# EAGLE design resonant-bp (EAGLE 7.7.0)
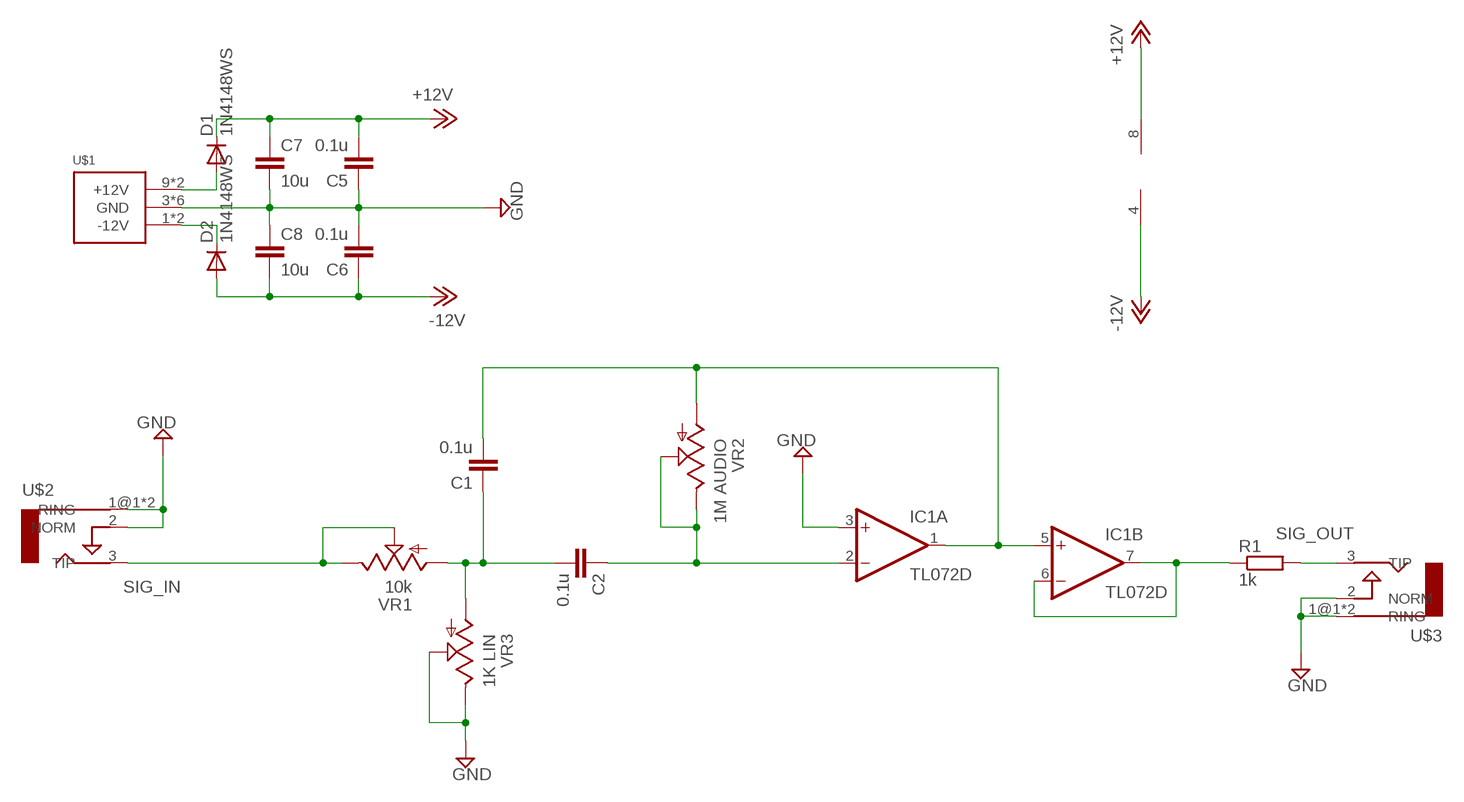
[diagram p0: schematic, sheet 1]

## Parts
C1  0.1u  C-EUC0805  [C0805]
C2  0.1u  C-EUC0805  [C0805]
C5  0.1u  C-EUC0805  [C0805]
C6  0.1u  C-EUC0805  [C0805]
C7  10u  C-EUC0805  [C0805]
C8  10u  C-EUC0805  [C0805]
D1  1N4148WS  DIODE-SOD323-W  [SOD323-W]
D2  1N4148WS  DIODE-SOD323-W  [SOD323-W]
IC1  TL072D  [SO08]
R1  1k  R-EU_R0805  [R0805]
U$1  POWER_SIMPLE10  [POWER_10]
U$2  AUDIO-JACKERTHENVAR  [ERTHENVAR-JACK]
U$3  AUDIO-JACKERTHENVAR  [ERTHENVAR-JACK]
VR1  10k  9MM_SNAP-IN_POT_  [9MM_SNAP-IN_POT]
VR2  1M AUDIO  9MM_SNAP-IN_POT_  [9MM_SNAP-IN_POT]
VR3  1K LIN  9MM_SNAP-IN_POT_  [9MM_SNAP-IN_POT]

## Nets
+12V: C5.2 C7.1 D1.C IC1.8(P:V+)
-12V: C6.1 C8.2 D2.A IC1.4(P:V-)
GND: C5.1 C6.2 C7.2 C8.1 IC1.3(A:+IN) U$1.3(GND) U$1.4(GND) U$1.5(GND) U$1.6(GND) U$1.7(GND) U$1.8(GND) U$2.1@1(RING) U$2.1@2(RING) U$2.2(NORM) U$3.1@1(RING) U$3.1@2(RING) U$3.2(NORM) VR3.2(S) VR3.3(E)
N$1: C1.1 C2.2 VR1.1(A) VR3.1(A)
N$2: D2.C U$1.1(-12V) U$1.2(-12V)
N$3: D1.A U$1.9(+12V) U$1.10(+12V)
N$4: C1.2 IC1.1(A:OUT) IC1.5(B:+IN) VR2.1(A)
N$5: C2.1 IC1.2(A:-IN) VR2.2(S) VR2.3(E)
N$9: IC1.6(B:-IN) IC1.7(B:OUT) R1.1
SIG_IN: U$2.3(TIP) VR1.2(S) VR1.3(E)
SIG_OUT: R1.2 U$3.3(TIP)

## Library data of the parts
C1 C2 C5-C8 = rcl:C-EU: CAPACITOR, European symbol
D1 D2 = diode:DIODE-: DIODE
IC1 = linear:TL072: OP AMP
R1 = rcl:R-EU_: RESISTOR, European symbol
U$1 = eurorack:POWER_SIMPLE
U$2 U$3 = erthenvar:AUDIO-JACK: Switching Mono 3.5mm Audio Jack from Erthenvar.
VR1-VR3 = MusicThingModular:9MM_SNAP-IN_POT: 9mm vertical snap-in pot, Alpha / Panasonic style

## Board
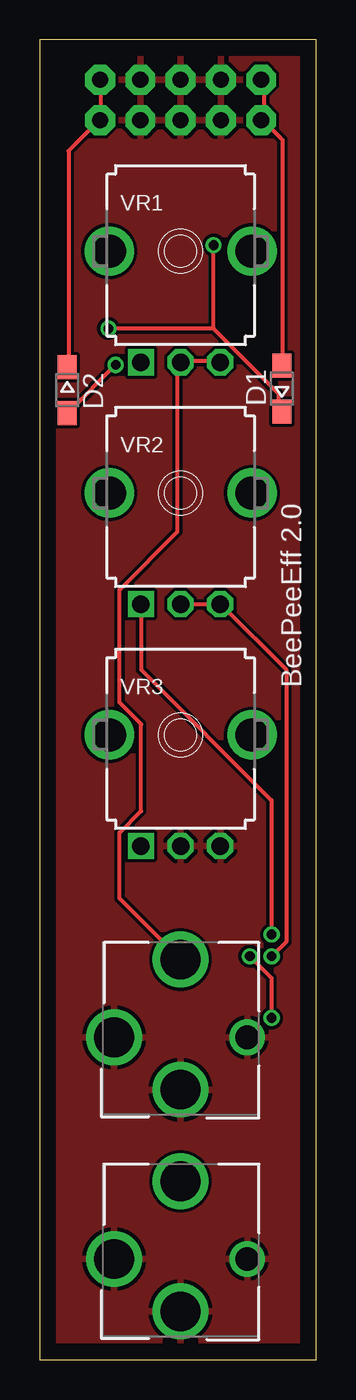
[diagram p1: board, top side]
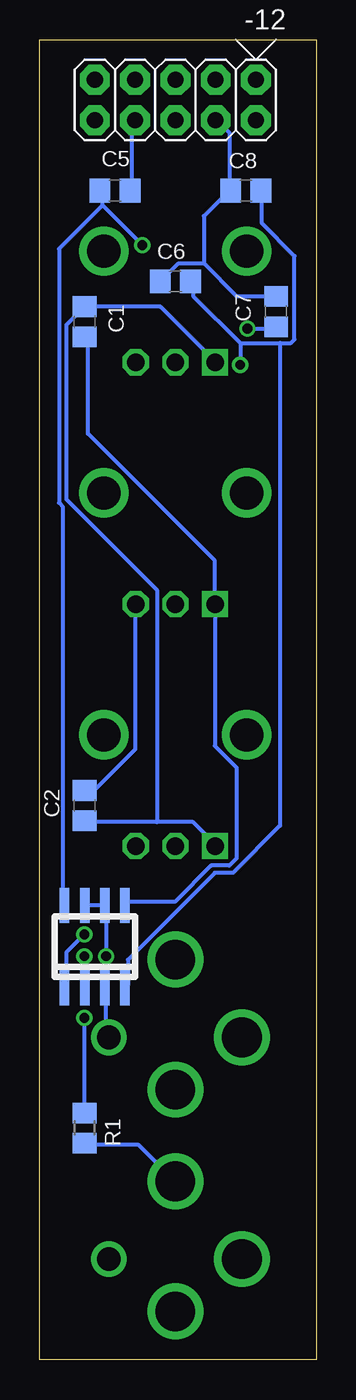
[diagram p2: board, bottom side, seen from below]

Size 17.45 x 83.17 mm. Coordinates in mm from the lower left corner, seen from the top.
Outline: 0,0 17.45,0 17.45,83.17 0,83.17 0,0
Copper layers (1*16): Top 0.035mm / dielectric 1.5mm / Bottom 0.035mm
Design rules "default": minimum track width 10mil, minimum drill 24mil, track to track 8mil, track to pad 8mil, pad to pad 8mil, via to via 8mil, smd to smd 8mil, copper to edge 40mil, drill to drill 8mil, minimum pad ring 10mil, minimum via ring 8mil, stop-mask expansion 4mil, vias tented up to drill 0mil, thermal gap 10mil

### Footprints (pad centres in the part's own frame; a part is rotated, then mirrored left to right if it is on the bottom)
C0805 = smd 1.3 x 1.5: 1 -0.95,0; 2 0.95,0
SOD323-W = smd 1.5 x 1.2: A 1.45,0; C -1.45,0
SO08 = smd 0.6 x 2.2: 1 -1.905,-2.6; 2 -0.635,-2.6; 3 0.635,-2.6; 4 1.905,-2.6; 5 1.905,2.6; 6 0.635,2.6; 7 -0.635,2.6; 8 -1.905,2.6
R0805 = smd 1.3 x 1.5: 1 -0.95,0; 2 0.95,0
POWER_10 = drill 1.016 pad 1.88 octagon: 1 -5.08,-1.27; 2 -5.08,1.27; 3 -2.54,-1.27; 4 -2.54,1.27; 5 0,-1.27; 6 0,1.27; 7 2.54,-1.27; 8 2.54,1.27; 9 5.08,-1.27; 10 5.08,1.27
ERTHENVAR-JACK = drill 2.5: 1@1 -4.2,0; 2 0,-3.3; 3 0,4.9 | drill 1.5: 1@2 4.2,0
9MM_SNAP-IN_POT = drill 1.1 square: 1 -2.5,-7 | drill 1.1 octagon: 2 0,-7; 3 2.5,-7 | drill 2.1 pad 2.794: CHASSIS1 -4.5,0; CHASSIS2 4.5,0

### Placement (x,y rotation side)
C1  14.61,65.41 270 bottom
C2  14.61,34.93 270 bottom
C5  12.7,73.66 180 bottom
C6  8.89,67.94 180 bottom
C7  2.54,66.04 90 bottom
C8  4.45,73.66 0 bottom
D1  15.28,61.19 90 top
D2  1.74,61.1 270 top
IC1  13.97,26.04 0 bottom
R1  14.61,14.61 270 bottom
U$1  8.89,79.38 180 bottom
U$2  8.89,20.32 0 top
U$3  8.89,6.35 0 top
VR1  8.89,69.85 0 top
VR2  8.89,54.61 0 top
VR3  8.89,39.37 0 top

### Tracks (layer width: path | path; a pad name or v marks a point on that pad's centre or on a via)
+12V  (via drill 0.61)
  Top 0.254: 10.97,64.97 v4.34,64.97 | 10.97,64.97 15.09,60.86 15.09,59.94 D1.C | 10.97,64.97 v10.97,70.23
  Bottom 0.254: v4.34,64.97 2.74,64.97 C7.1 | 13.49,72.75 13.49,73.66 C5.2 | v10.97,70.23 13.49,72.75 | 13.49,72.75 16.23,70 16.23,54 16,53.77 16,28.85 IC1.8
-12V  (via drill 0.61)
  Top 0.254: v4.8,62.69 1.83,59.72 D2.A
  Bottom 0.254: 4.8,64.06 v4.8,62.69 | 4.8,64.06 7.77,67.03 7.77,67.94 C6.1 | 4.8,64.06 2.29,64.06 | 2.29,64.06 1.6,64.06 1.37,64.29 1.37,69.55 3.43,71.6 3.43,73.66 C8.2 | 2.29,64.06 2.29,33.66 5.26,30.68 6.4,30.68 11.89,25.2 11.89,23.6 IC1.4
GND
  Bottom 0.254: 7.09,69.09 5.03,67.03 2.74,67.03 C7.2 | 7.09,69.09 8.69,69.09 C6.2 | 5.49,73.66 5.49,77.32 6.17,78 U$1.4 | C5.1 11.66,73.66 11.66,77.77 11.43,78 U$1.8 | IC1.3 13.26,23.37 13.26,20.4 U$2.1@2 | 7.09,69.09 7.09,72.06 5.49,73.66 | 5.49,73.66 C8.1
  pour Top: 0,83.18 17.78,83.18 17.78,-0.64 0,-0.64
N$1
  Bottom 0.254: 10.06,33.88 7.77,33.88 6.4,32.51 VR3.1 | 10.06,33.88 14.4,33.88 C2.2 | VR1.1 6.4,62.92 9.83,66.34 14.4,66.34 C1.1 14.63,66.34 15.77,65.2 15.77,54.23 10.06,48.51 10.06,33.88
N$2
  Top 0.254: D2.C 1.83,62.69 1.83,76.17 3.66,78 U$1.2 3.89,78.23 3.89,80.52 U$1.1
N$3
  Top 0.254: D1.A 15.32,62.69 15.32,76.86 14.17,78 U$1.10 14.17,78.23 14.17,80.52 U$1.9
N$4  (via drill 0.61)
  Top 0.254: v14.63,26.8 14.63,35.26 6.4,43.48 VR2.1
  Bottom 0.254: C1.2 14.4,64.29 14.4,58.34 6.4,50.34 6.4,47.83 VR2.1 6.4,38.68 5.03,37.31 5.03,31.6 5.49,31.14 6.63,31.14 8.91,28.85 11.89,28.85 IC1.5 | v14.63,26.8 15.77,25.65 15.77,23.6 IC1.1
N$5  (via drill 0.61)
  Top 0.254: v14.63,25.42 15.54,26.34 15.54,43.48 11.43,47.6 VR2.3 11.2,47.6 8.91,47.6 VR2.2
  Bottom 0.254: C2.1 14.4,35.94 13.95,35.94 11.43,38.46 11.43,47.6 VR2.3 | v14.63,25.42 14.63,23.6 IC1.2
N$9  (via drill 0.61)
  Top 0.254: v14.63,21.54 14.63,24.05 v13.26,25.42
  Bottom 0.254: v14.63,21.54 14.63,15.6 R1.1 | v13.26,25.42 13.26,28.63 IC1.6 13.49,28.63 14.4,28.63 IC1.7
SIG_IN
  Top 0.254: VR1.3 11.2,62.92 8.91,62.92 VR1.2 8.69,62.69 8.69,52.17 5.03,48.51 5.03,41.43 6.4,40.06 6.4,34.57 5.03,33.2 5.03,29.08 8.69,25.42 U$2.3
SIG_OUT
  Bottom 0.254: R1.2 14.4,13.54 11.2,13.54 8.91,11.25 U$3.3

### Text on the board
tNames: BeePeeEff 2.0